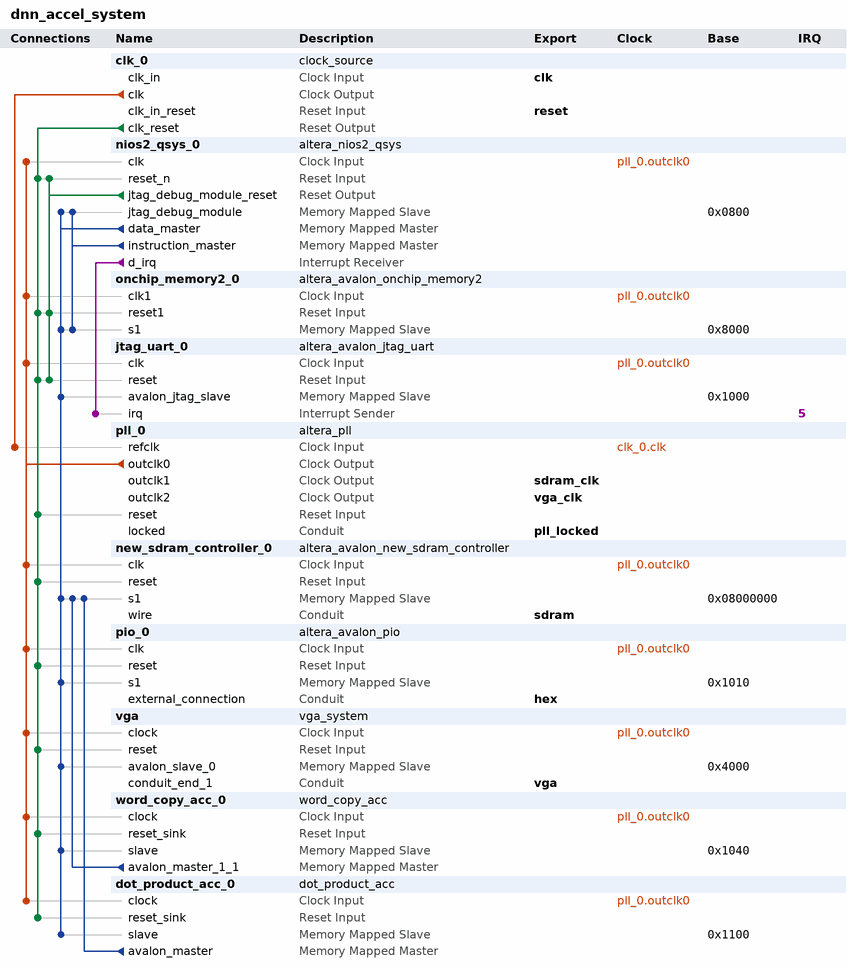
[diagram p0: system contents]
# Platform Designer (Qsys) system dnn_accel_system, Cyclone V 5CSEMA5F31C6
# Parameters at their usual value, and those the tool derives, are not listed.
package require -exact qsys 18.1
create_system dnn_accel_system
set_project_property DEVICE_FAMILY {Cyclone V}
set_project_property DEVICE 5CSEMA5F31C6

add_instance clk_0 clock_source 18.1
set_instance_parameter_value clk_0 clockFrequency 50000000

add_instance nios2_qsys_0 altera_nios2_qsys 16.1
set_instance_parameter_value nios2_qsys_0 breakSlave nios2_qsys_0.jtag_debug_module
set_instance_parameter_value nios2_qsys_0 exceptionSlave onchip_memory2_0.s1
set_instance_parameter_value nios2_qsys_0 icache_size 4096
set_instance_parameter_value nios2_qsys_0 impl Tiny
set_instance_parameter_value nios2_qsys_0 mmu_TLBMissExcSlave None
set_instance_parameter_value nios2_qsys_0 resetSlave onchip_memory2_0.s1
set_instance_parameter_value nios2_qsys_0 resetrequest_enabled true

add_instance onchip_memory2_0 altera_avalon_onchip_memory2 18.1
set_instance_parameter_value onchip_memory2_0 dataWidth 32
set_instance_parameter_value onchip_memory2_0 dualPort false
set_instance_parameter_value onchip_memory2_0 initMemContent true
set_instance_parameter_value onchip_memory2_0 initializationFileName onchip_mem.hex
set_instance_parameter_value onchip_memory2_0 memorySize 4096

add_instance jtag_uart_0 altera_avalon_jtag_uart 18.1
set_instance_parameter_value jtag_uart_0 simInteractiveOptions NO_INTERACTIVE_WINDOWS

add_instance pll_0 altera_pll 18.1
set_instance_parameter_value pll_0 gui_device_speed_grade 1
set_instance_parameter_value pll_0 gui_number_of_clocks 3
set_instance_parameter_value pll_0 gui_operation_mode direct
set_instance_parameter_value pll_0 gui_output_clock_frequency0 50.0
set_instance_parameter_value pll_0 gui_output_clock_frequency1 50.0
set_instance_parameter_value pll_0 gui_output_clock_frequency2 25.0
set_instance_parameter_value pll_0 gui_phase_shift1 -3000
set_instance_parameter_value pll_0 gui_pll_mode {Integer-N PLL}
set_instance_parameter_value pll_0 gui_reference_clock_frequency 50.0
set_instance_parameter_value pll_0 gui_use_locked true

add_instance new_sdram_controller_0 altera_avalon_new_sdram_controller 18.1
set_instance_parameter_value new_sdram_controller_0 TAC 5.4
set_instance_parameter_value new_sdram_controller_0 TRCD 15.0
set_instance_parameter_value new_sdram_controller_0 TRP 15.0
set_instance_parameter_value new_sdram_controller_0 casLatency 3
set_instance_parameter_value new_sdram_controller_0 columnWidth 10
set_instance_parameter_value new_sdram_controller_0 dataWidth 16
set_instance_parameter_value new_sdram_controller_0 generateSimulationModel false
set_instance_parameter_value new_sdram_controller_0 model single_Micron_MT48LC4M32B2_7_chip
set_instance_parameter_value new_sdram_controller_0 numberOfBanks 4
set_instance_parameter_value new_sdram_controller_0 numberOfChipSelects 1
set_instance_parameter_value new_sdram_controller_0 powerUpDelay 100.0
set_instance_parameter_value new_sdram_controller_0 refreshPeriod 7.8125
set_instance_parameter_value new_sdram_controller_0 rowWidth 13

add_instance pio_0 altera_avalon_pio 18.1
set_instance_parameter_value pio_0 direction Output
set_instance_parameter_value pio_0 resetValue 127
set_instance_parameter_value pio_0 width 7

add_instance vga vga_system 1.0

add_instance word_copy_acc_0 word_copy_acc 1.0
set_instance_parameter_value word_copy_acc_0 COLLECT 9
set_instance_parameter_value word_copy_acc_0 HOLD_DST 2
set_instance_parameter_value word_copy_acc_0 HOLD_N 6
set_instance_parameter_value word_copy_acc_0 HOLD_SRC 4
set_instance_parameter_value word_copy_acc_0 INCREMENT 11
set_instance_parameter_value word_copy_acc_0 INIT 0
set_instance_parameter_value word_copy_acc_0 RECORD_DST 1
set_instance_parameter_value word_copy_acc_0 RECORD_N 5
set_instance_parameter_value word_copy_acc_0 RECORD_SRC 3
set_instance_parameter_value word_copy_acc_0 SEND_DATA 10
set_instance_parameter_value word_copy_acc_0 START_READ 7
set_instance_parameter_value word_copy_acc_0 WAIT_READ 8

add_instance dot_product_acc_0 dot_product_acc 1.0
set_instance_parameter_value dot_product_acc_0 COLLECT_IF 13
set_instance_parameter_value dot_product_acc_0 COLLECT_W 10
set_instance_parameter_value dot_product_acc_0 HOLD 7
set_instance_parameter_value dot_product_acc_0 HOLD_IF 4
set_instance_parameter_value dot_product_acc_0 HOLD_N 6
set_instance_parameter_value dot_product_acc_0 HOLD_W 2
set_instance_parameter_value dot_product_acc_0 INCREMENT 16
set_instance_parameter_value dot_product_acc_0 INIT 0
set_instance_parameter_value dot_product_acc_0 MULTIPLY 14
set_instance_parameter_value dot_product_acc_0 RECORD_IF 3
set_instance_parameter_value dot_product_acc_0 RECORD_N 5
set_instance_parameter_value dot_product_acc_0 RECORD_W 1
set_instance_parameter_value dot_product_acc_0 SEND_DATA 18
set_instance_parameter_value dot_product_acc_0 SHIFT 15
set_instance_parameter_value dot_product_acc_0 START_READ_IF 11
set_instance_parameter_value dot_product_acc_0 START_READ_W 8
set_instance_parameter_value dot_product_acc_0 WAIT_FOR_STABLE_IF 20
set_instance_parameter_value dot_product_acc_0 WAIT_FOR_STABLE_W 19
set_instance_parameter_value dot_product_acc_0 WAIT_READ_IF 12
set_instance_parameter_value dot_product_acc_0 WAIT_READ_W 9
set_instance_parameter_value dot_product_acc_0 WAIT_TO_SEND 17

# connections
add_connection clk_0.clk pll_0.refclk clock
add_connection pll_0.outclk0 dot_product_acc_0.clock clock
add_connection pll_0.outclk0 jtag_uart_0.clk clock
add_connection pll_0.outclk0 new_sdram_controller_0.clk clock
add_connection pll_0.outclk0 nios2_qsys_0.clk clock
add_connection pll_0.outclk0 onchip_memory2_0.clk1 clock
add_connection pll_0.outclk0 pio_0.clk clock
add_connection pll_0.outclk0 vga.clock clock
add_connection pll_0.outclk0 word_copy_acc_0.clock clock
add_connection clk_0.clk_reset dot_product_acc_0.reset_sink reset
add_connection clk_0.clk_reset jtag_uart_0.reset reset
add_connection clk_0.clk_reset new_sdram_controller_0.reset reset
add_connection clk_0.clk_reset nios2_qsys_0.reset_n reset
add_connection clk_0.clk_reset onchip_memory2_0.reset1 reset
add_connection clk_0.clk_reset pio_0.reset reset
add_connection clk_0.clk_reset pll_0.reset reset
add_connection clk_0.clk_reset vga.reset reset
add_connection clk_0.clk_reset word_copy_acc_0.reset_sink reset
add_connection nios2_qsys_0.jtag_debug_module_reset jtag_uart_0.reset reset
add_connection nios2_qsys_0.jtag_debug_module_reset nios2_qsys_0.reset_n reset
add_connection nios2_qsys_0.jtag_debug_module_reset onchip_memory2_0.reset1 reset
add_connection dot_product_acc_0.avalon_master new_sdram_controller_0.s1 avalon
set_connection_parameter_value dot_product_acc_0.avalon_master/new_sdram_controller_0.s1 baseAddress 0x08000000
add_connection nios2_qsys_0.data_master dot_product_acc_0.slave avalon
set_connection_parameter_value nios2_qsys_0.data_master/dot_product_acc_0.slave baseAddress 0x1100
add_connection nios2_qsys_0.data_master jtag_uart_0.avalon_jtag_slave avalon
set_connection_parameter_value nios2_qsys_0.data_master/jtag_uart_0.avalon_jtag_slave baseAddress 0x1000
add_connection nios2_qsys_0.data_master new_sdram_controller_0.s1 avalon
set_connection_parameter_value nios2_qsys_0.data_master/new_sdram_controller_0.s1 baseAddress 0x08000000
add_connection nios2_qsys_0.data_master nios2_qsys_0.jtag_debug_module avalon
set_connection_parameter_value nios2_qsys_0.data_master/nios2_qsys_0.jtag_debug_module baseAddress 0x0800
add_connection nios2_qsys_0.data_master onchip_memory2_0.s1 avalon
set_connection_parameter_value nios2_qsys_0.data_master/onchip_memory2_0.s1 baseAddress 0x8000
add_connection nios2_qsys_0.data_master pio_0.s1 avalon
set_connection_parameter_value nios2_qsys_0.data_master/pio_0.s1 baseAddress 0x1010
add_connection nios2_qsys_0.data_master vga.avalon_slave_0 avalon
set_connection_parameter_value nios2_qsys_0.data_master/vga.avalon_slave_0 baseAddress 0x4000
add_connection nios2_qsys_0.data_master word_copy_acc_0.slave avalon
set_connection_parameter_value nios2_qsys_0.data_master/word_copy_acc_0.slave baseAddress 0x1040
add_connection nios2_qsys_0.instruction_master nios2_qsys_0.jtag_debug_module avalon
set_connection_parameter_value nios2_qsys_0.instruction_master/nios2_qsys_0.jtag_debug_module baseAddress 0x0800
add_connection nios2_qsys_0.instruction_master onchip_memory2_0.s1 avalon
set_connection_parameter_value nios2_qsys_0.instruction_master/onchip_memory2_0.s1 baseAddress 0x8000
add_connection word_copy_acc_0.avalon_master_1_1 new_sdram_controller_0.s1 avalon
set_connection_parameter_value word_copy_acc_0.avalon_master_1_1/new_sdram_controller_0.s1 baseAddress 0x08000000
add_connection nios2_qsys_0.d_irq jtag_uart_0.irq interrupt
set_connection_parameter_value nios2_qsys_0.d_irq/jtag_uart_0.irq irqNumber 5

# exported interfaces
add_interface clk clock sink
set_interface_property clk EXPORT_OF clk_0.clk_in
add_interface hex conduit end
set_interface_property hex EXPORT_OF pio_0.external_connection
add_interface pll_locked conduit end
set_interface_property pll_locked EXPORT_OF pll_0.locked
add_interface reset reset sink
set_interface_property reset EXPORT_OF clk_0.clk_in_reset
add_interface sdram conduit end
set_interface_property sdram EXPORT_OF new_sdram_controller_0.wire
add_interface sdram_clk clock source
set_interface_property sdram_clk EXPORT_OF pll_0.outclk1
add_interface vga conduit end
set_interface_property vga EXPORT_OF vga.conduit_end_1
add_interface vga_clk clock source
set_interface_property vga_clk EXPORT_OF pll_0.outclk2

set_interconnect_requirement {$system} qsys_mm.clockCrossingAdapter HANDSHAKE
set_interconnect_requirement {$system} qsys_mm.enableEccProtection FALSE
set_interconnect_requirement {$system} qsys_mm.insertDefaultSlave FALSE
set_interconnect_requirement {$system} qsys_mm.maxAdditionalLatency 1

save_system dnn_accel_system.qsys
